# EAGLE schematic MCU_03 (EAGLE 7.3.0)
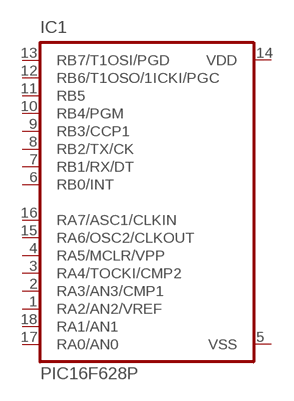
[diagram p0: schematic, sheet 1]

## Parts
IC1  PIC16F628P  [DIL18]
Unconnected: IC1.1(RA2/AN2/VREF) IC1.2(RA3/AN3/CMP1) IC1.3(RA4/TOCKI/CMP2) IC1.4(RA5/MCLR/VPP) IC1.6(RB0/INT) IC1.7(RB1/RX/DT) IC1.8(RB2/TX/CK) IC1.9(RB3/CCP1) IC1.10(RB4/PGM) IC1.11(RB5) IC1.12(RB6/T1OSO/1ICKI/PGC) IC1.13(RB7/T1OSI/PGD) IC1.15(RA6/OSC2/CLKOUT) IC1.16(RA7/ASC1/CLKIN) IC1.17(RA0/AN0) IC1.18(RA1/AN1)

## Power pins joined to a net without a drawn wire
VDD: IC1.14(VDD)
VSS: IC1.5(VSS)

## Library data of the parts
IC1 = microchip:PIC16*F62: FLASH-Based 8-Bit CMOS Microcontroller Source: http://ww1.microchip.com/downloads/en/DeviceDoc/40300C.pdf; MF: MICROCHIP; MPN: PIC16F628-20/P; OC_FARNELL: 9760423; OC_NEWARK: 23C4982